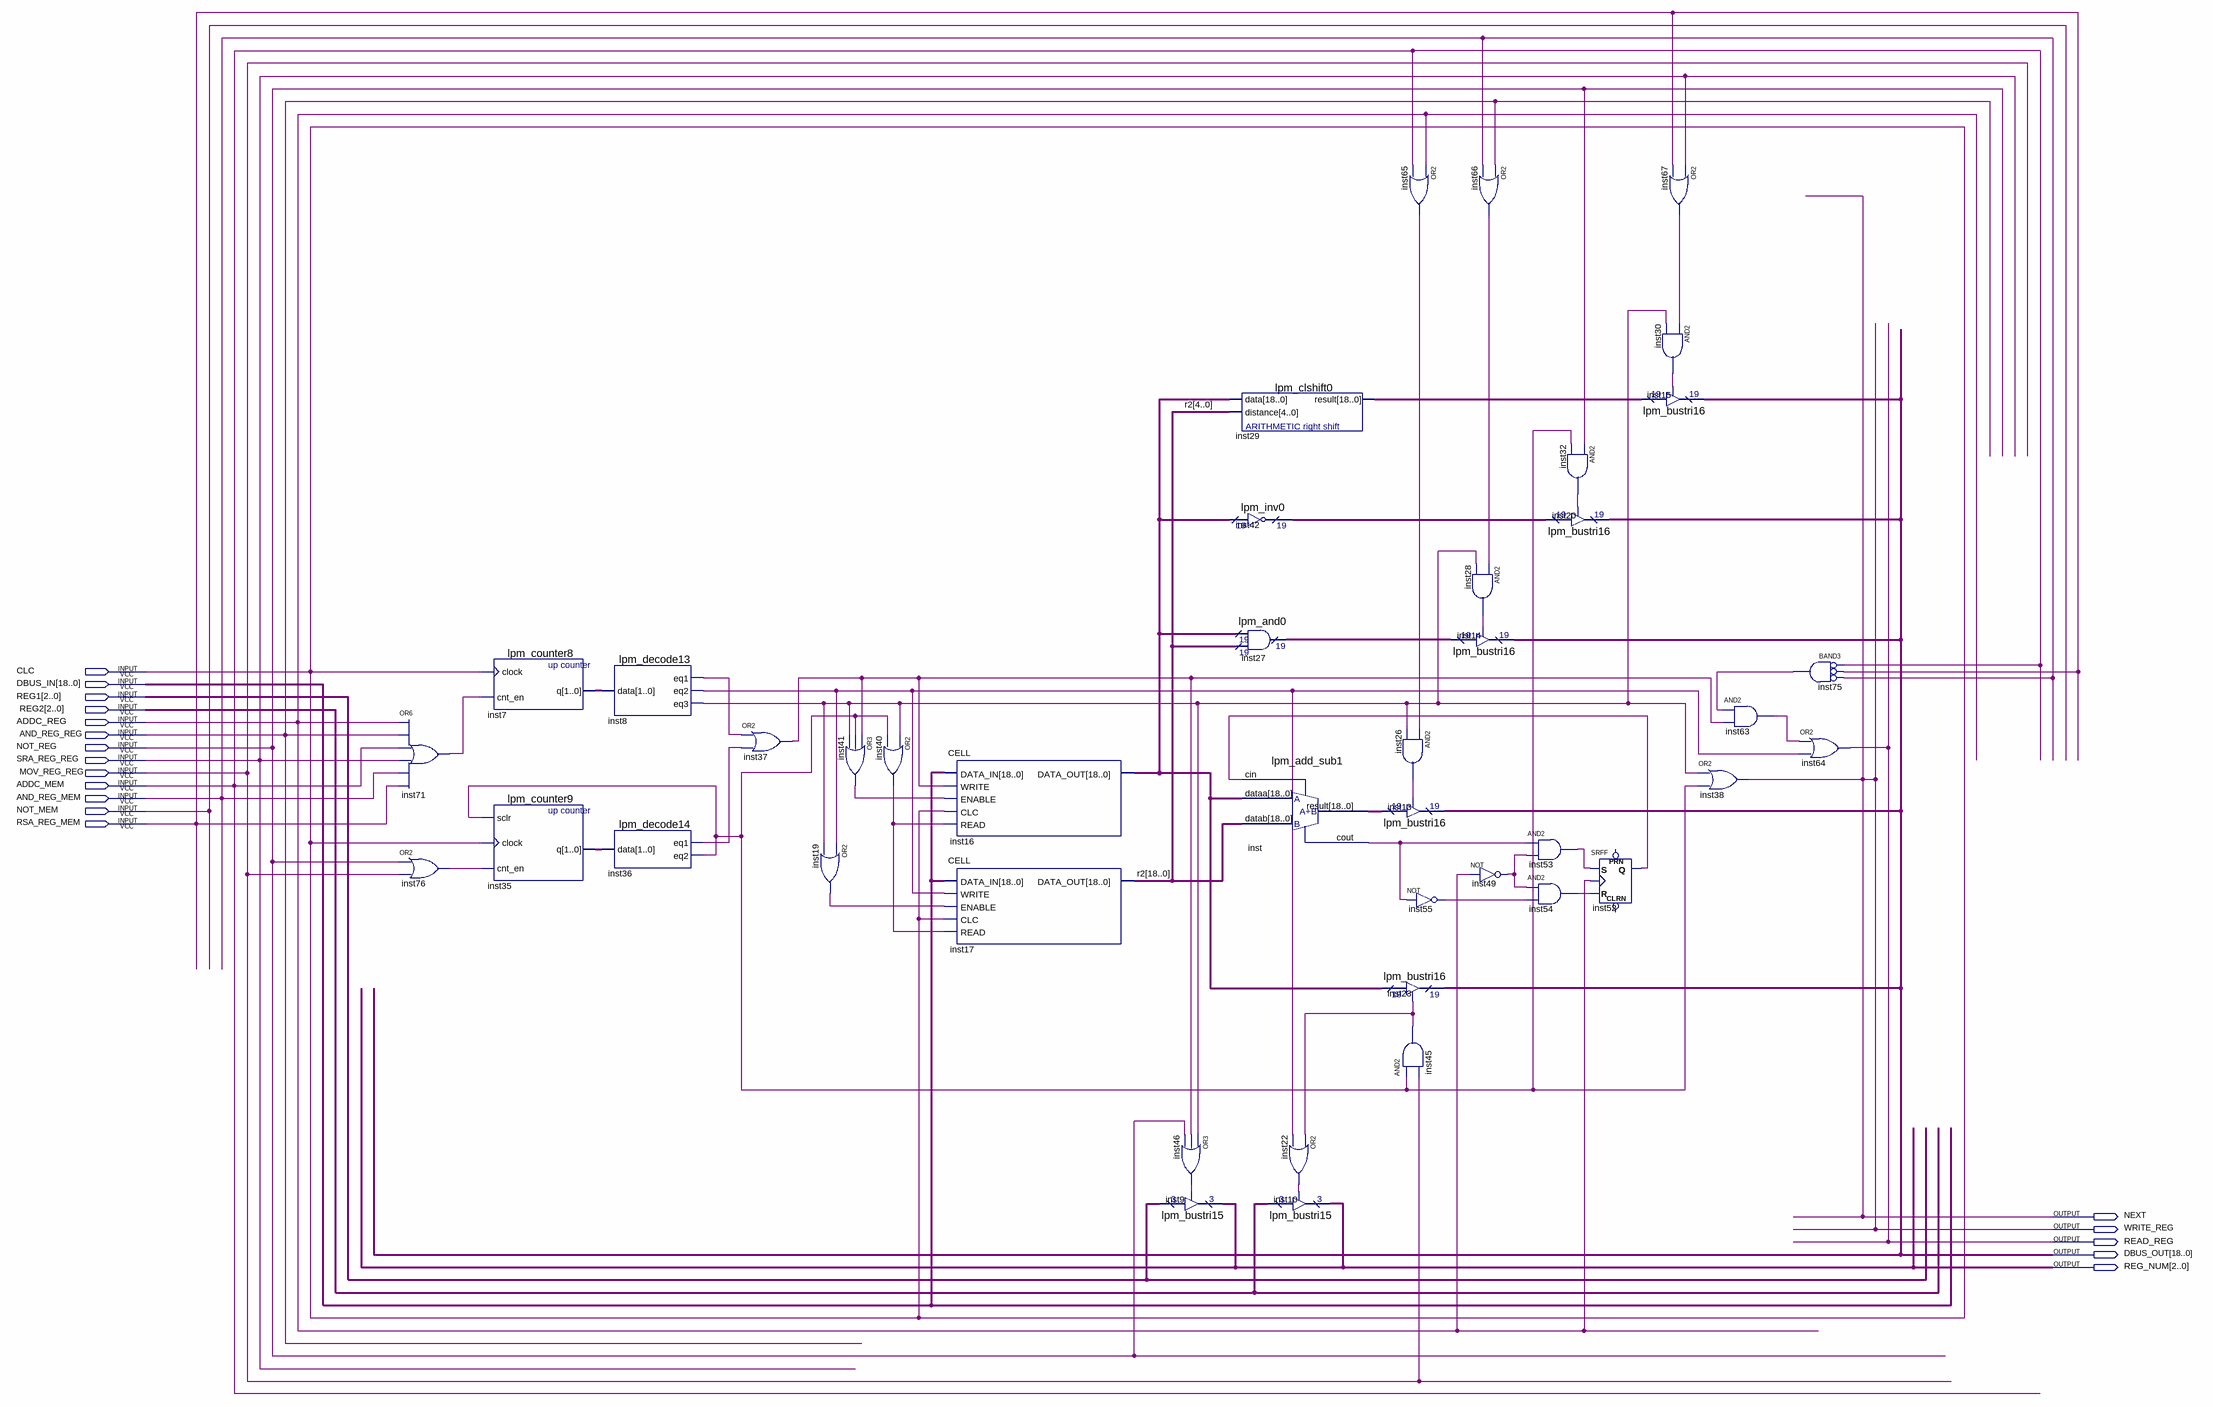
[diagram p0: schematic sheet]
// Quartus schematic ALU.bdf as structural Verilog: 42 symbols, 18 pins
module ALU (
  input  CLC,
  input  [18:0] DBUS_IN,
  input  [2:0] REG1,
  input  [2:0] REG2,
  input  ADDC_REG,
  input  AND_REG_REG,
  input  NOT_REG,
  input  SRA_REG_REG,
  input  MOV_REG_REG,
  input  ADDC_MEM,
  input  AND_REG_MEM,
  input  NOT_MEM,
  input  RSA_REG_MEM,
  output NEXT,
  output WRITE_REG,
  output READ_REG,
  output [18:0] DBUS_OUT,
  output [2:0] REG_NUM
);

  wire inst8_eq1, inst8_eq2, inst8_eq3, inst19_out, inst22_out, inst26_out, inst28_out, inst30_out,
       inst32_out, inst36_eq1, inst36_eq2, inst37_out, inst40_out, inst41_out, inst45_out, inst46_out,
       inst49_out, inst52_q, inst53_out, inst54_out, inst55_out, inst63_out, inst65_out, inst66_out,
       inst67_out, inst71_out, inst75_out, inst76_out, inst_cout;
  wire [1:0] inst7_q, inst35_q;
  wire [18:0] inst16_data_out, inst27_result, inst29_result, inst42_result, inst_result, r2;

  or inst71 (inst71_out, ADDC_REG, AND_REG_REG, ADDC_MEM, SRA_REG_REG, AND_REG_MEM, RSA_REG_MEM);
  or inst76 (inst76_out, NOT_REG, MOV_REG_REG);
  lpm_counter8 inst7 (.clock(CLC), .cnt_en(inst71_out), .q(inst7_q));
  lpm_counter9 inst35 (.sclr(inst36_eq2), .clock(CLC), .cnt_en(inst76_out), .q(inst35_q));
  lpm_decode13 inst8 (.data(inst7_q), .eq1(inst8_eq1), .eq2(inst8_eq2), .eq3(inst8_eq3));
  lpm_decode14 inst36 (.data(inst35_q), .eq1(inst36_eq1), .eq2(inst36_eq2));
  or inst37 (inst37_out, inst8_eq1, inst36_eq1);
  or inst19 (inst19_out, inst8_eq2, inst8_eq3);
  or inst41 (inst41_out, inst37_out, inst36_eq2, inst8_eq3);
  or inst40 (inst40_out, inst8_eq3, inst36_eq2);
  CELL inst16 (
    .DATA_IN(DBUS_IN), .WRITE(inst37_out), .ENABLE(inst41_out), .CLC(CLC), .READ(inst40_out),
    .DATA_OUT(inst16_data_out));
  CELL inst17 (.DATA_IN(DBUS_IN), .WRITE(inst8_eq2), .ENABLE(inst19_out), .CLC(CLC), .READ(inst40_out), .DATA_OUT(r2));
  or inst46 (inst46_out, inst8_eq3, inst37_out, NOT_REG);
  lpm_bustri15 inst9 (.enabledt(inst46_out), .data(REG1), .tridata(REG_NUM));
  lpm_clshift0 inst29 (.data(inst16_data_out), .distance(r2[4:0]), .result(inst29_result));
  lpm_inv0 inst42 (.data(inst16_data_out), .result(inst42_result));
  lpm_and0 inst27 (.data0x(inst16_data_out), .data1x(r2), .result(inst27_result));
  lpm_add_sub1 inst (.dataa(inst16_data_out), .datab(r2), .cin(inst52_q), .result(inst_result), .cout(inst_cout));
  or inst22 (inst22_out, inst45_out, inst8_eq2);
  lpm_bustri15 inst10 (.enabledt(inst22_out), .data(REG2), .tridata(REG_NUM));
  lpm_bustri16 inst13 (.enabledt(inst26_out), .data(inst_result), .tridata(DBUS_OUT));
  lpm_bustri16 inst23 (.enabledt(inst45_out), .data(inst16_data_out), .tridata(DBUS_OUT));
  or inst65 (inst65_out, ADDC_REG, ADDC_MEM);
  and inst26 (inst26_out, inst65_out, inst8_eq3);
  not inst55 (inst55_out, inst_cout);
  and inst45 (inst45_out, inst36_eq2, MOV_REG_REG);
  or inst66 (inst66_out, AND_REG_REG, AND_REG_MEM);
  and inst28 (inst28_out, inst66_out, inst8_eq3);
  lpm_bustri16 inst14 (.enabledt(inst28_out), .data(inst27_result), .tridata(DBUS_OUT));
  not inst49 (inst49_out, ADDC_REG);
  and inst53 (inst53_out, inst_cout, inst49_out);
  and inst54 (inst54_out, inst49_out, inst55_out);
  and inst32 (inst32_out, NOT_REG, inst36_eq2);
  lpm_bustri16 inst20 (.enabledt(inst32_out), .data(inst42_result), .tridata(DBUS_OUT));
  SRFF inst52 (.S(inst53_out), .R(inst54_out), .CLK(ADDC_REG), .Q(inst52_q));  // open: PRN, CLRN
  or inst67 (inst67_out, SRA_REG_REG, RSA_REG_MEM);
  and inst30 (inst30_out, inst67_out, inst8_eq3);
  lpm_bustri16 inst15 (.enabledt(inst30_out), .data(inst29_result), .tridata(DBUS_OUT));
  and inst63 (inst63_out, inst75_out, inst37_out);
  or inst38 (NEXT, inst8_eq3, inst36_eq2);
  and inst75 (inst75_out, ~ADDC_MEM, ~RSA_REG_MEM, ~AND_REG_MEM);  // BAND3
  or inst64 (READ_REG, inst63_out, inst8_eq2);

  assign WRITE_REG = NEXT;
endmodule
